# Altium schematic sheet main.SchDoc
size A3
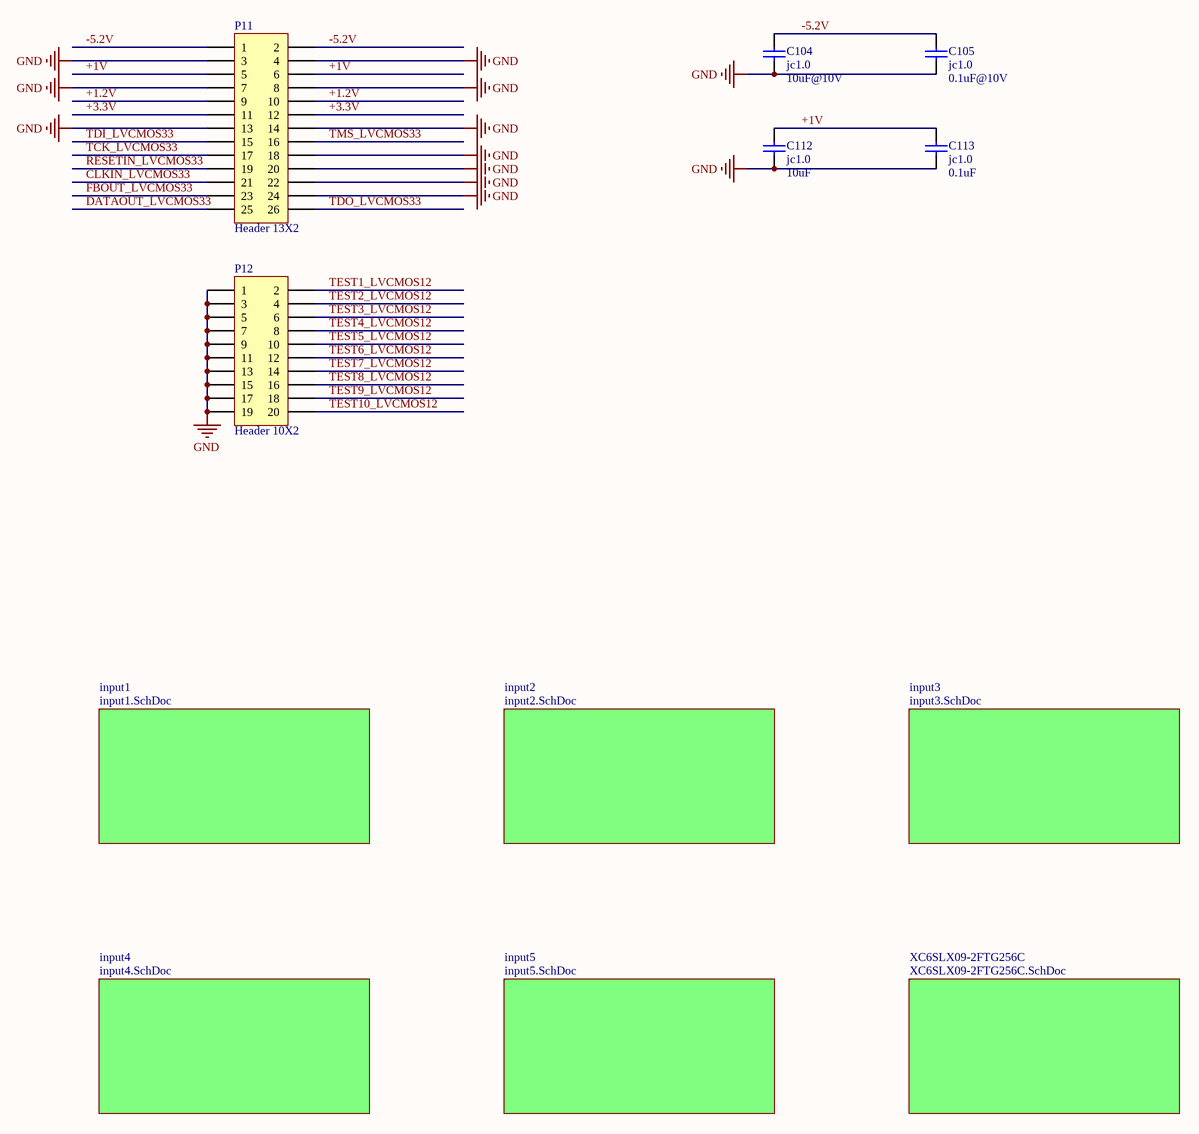
[diagram p0: main.SchDoc]

## Parts
C104  jc1.0  value 10uF@10V  [0805]
C105  jc1.0  value 0.1uF@10V  [0805]
C112  jc1.0  value 10uF  [0805]
C113  jc1.0  value 0.1uF  [0805]
P11  Header 13X2  [HDR2X13]
P12  Header 10X2  [HDR2X10]

## Sub-sheets
input1 = input1.SchDoc: no entries
input2 = input2.SchDoc: no entries
input3 = input3.SchDoc: no entries
input4 = input4.SchDoc: no entries
input5 = input5.SchDoc: no entries
XC6SLX09-2FTG256C = XC6SLX09-2FTG256C.SchDoc: no entries

## Nets
GND: C104.1 C105.1 C112.1 C113.1 P11.3 P11.4 P11.7 P11.8 P11.13 P11.14 P11.18 P11.20 P11.22 P11.24 P12.1 P12.3 P12.5 P12.7 P12.9 P12.11 P12.13 P12.15 P12.17 P12.19
+1.2V: P11.9 P11.10
+1V: C112.2 C113.2 P11.5 P11.6
+3.3V: P11.11 P11.12
-5.2V: C104.2 C105.2 P11.1 P11.2
CLKIN_LVCMOS33: P11.21
DATAOUT_LVCMOS33: P11.25
FBOUT_LVCMOS33: P11.23
RESETIN_LVCMOS33: P11.19
TCK_LVCMOS33: P11.17
TDI_LVCMOS33: P11.15
TDO_LVCMOS33: P11.26
TEST1_LVCMOS12: P12.2
TEST2_LVCMOS12: P12.4
TEST3_LVCMOS12: P12.6
TEST4_LVCMOS12: P12.8
TEST5_LVCMOS12: P12.10
TEST6_LVCMOS12: P12.12
TEST7_LVCMOS12: P12.14
TEST8_LVCMOS12: P12.16
TEST9_LVCMOS12: P12.18
TEST10_LVCMOS12: P12.20
TMS_LVCMOS33: P11.16

## Library data of the parts
C104 C105 C112 C113 = Cap: Capacitor; Published: 8-Jun-2000; LatestRevisionDate: 17-Jul-2002; LatestRevisionNote: Re-released for DXP Platform.; PackageReference: RAD-0.3; Publisher: Altium Limited
P11 = Header 13X2: Header, 13-Pin, Dual row; LatestRevisionDate: 17-Jul-2002; LatestRevisionNote: Re-released for DXP Platform.; Publisher: Altium Limited
P12 = Header 10X2: Header, 10-Pin, Dual row; LatestRevisionDate: 17-Jul-2002; LatestRevisionNote: Re-released for DXP Platform.; Publisher: Altium Limited